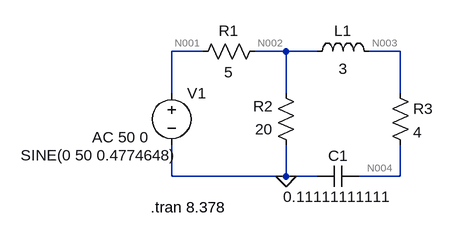
[diagram p0: schematic Task1-1.asc]
Task1-1.asc, the LTspice schematic file:
Version 4
SHEET 1 880 680
WIRE 176 48 128 48
WIRE 304 48 256 48
WIRE 352 48 304 48
WIRE 480 48 432 48
WIRE 128 112 128 48
WIRE 304 112 304 48
WIRE 480 112 480 48
WIRE 128 240 128 192
WIRE 304 240 304 192
WIRE 304 240 128 240
WIRE 352 240 304 240
WIRE 480 240 480 192
WIRE 480 240 416 240
FLAG 304 240 0
SYMBOL voltage 128 96 R0
WINDOW 123 -122 84 Left 2
WINDOW 39 0 0 Left 0
WINDOW 3 -232 112 Left 2
SYMATTR Value2 AC 50 0
SYMATTR Value SINE(0 50 0.4774648)
SYMATTR InstName V1
SYMBOL res 272 32 R90
WINDOW 0 0 56 VBottom 2
WINDOW 3 32 56 VTop 2
SYMATTR InstName R1
SYMATTR Value 5
SYMBOL res 320 208 R180
WINDOW 0 36 76 Left 2
WINDOW 3 36 40 Left 2
SYMATTR InstName R2
SYMATTR Value 20
SYMBOL ind 336 64 R270
WINDOW 0 32 56 VTop 2
WINDOW 3 5 56 VBottom 2
SYMATTR InstName L1
SYMATTR Value 3
SYMBOL cap 416 224 R90
WINDOW 0 0 32 VBottom 2
WINDOW 3 32 32 VTop 2
SYMATTR InstName C1
SYMATTR Value 0.11111111111
SYMBOL res 464 96 R0
SYMATTR InstName R3
SYMATTR Value 4
TEXT 96 288 Left 2 !.tran 8.378

The netlist it stands for:
* Task1-1.asc
V1 N001 0 SINE(0 50 0.4774648) AC 50 0
R1 N002 N001 5
R2 0 N002 20
L1 N002 N003 3
C1 N004 0 0.11111111111
R3 N003 N004 4
.tran 8.378
.backanno
.end

* Results of the author's LTspice run, read from the files saved beside the schematic
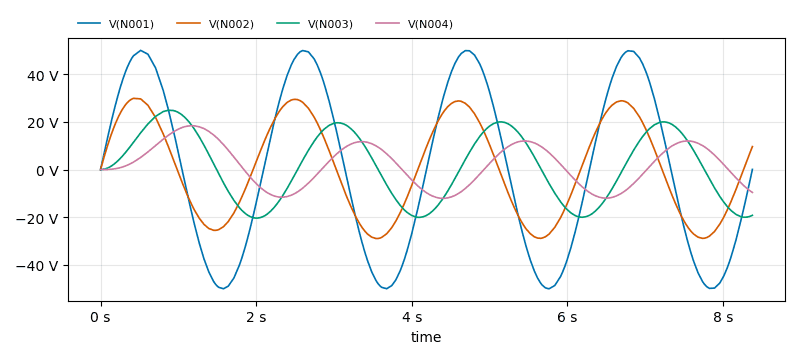
[diagram p1: Transient Analysis of Task1-1.asc, plotted from the saved traces]
* Transient Analysis, 1 run:
*   V(N001): min -50 V, max 49.98 V, average -7.966 mV, rms 35.32 V, last 62.86 mV
*   V(N002): min -28.91 V, max 29.86 V, average 505.6 mV, rms 20.18 V, last 9.633 V
*   V(N003): min -20.34 V, max 24.88 V, average 1.365 V, rms 14.62 V, last -19.19 V
*   V(N004): min -12.07 V, max 18.39 V, average 1.877 V, rms 9.083 V, last -9.608 V